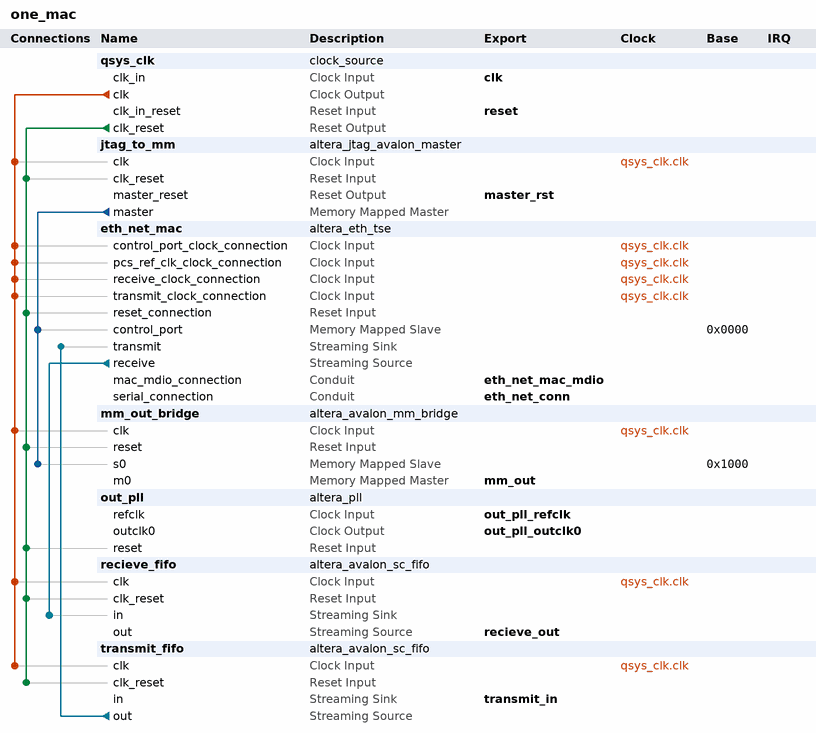
[diagram p0: system contents]
# Platform Designer (Qsys) system one_mac, Cyclone V 5CSXFC6D6F31I7
# Parameters at their usual value, and those the tool derives, are not listed.
package require -exact qsys 19.1
create_system one_mac
set_project_property DEVICE_FAMILY {Cyclone V}
set_project_property DEVICE 5CSXFC6D6F31I7

add_instance qsys_clk clock_source 19.1
set_instance_parameter_value qsys_clk clockFrequency 50000000

add_instance jtag_to_mm altera_jtag_avalon_master 19.1

add_instance eth_net_mac altera_eth_tse 19.1
set_instance_parameter_value eth_net_mac XCVR_RCFG_JTAG_ENABLE 0
set_instance_parameter_value eth_net_mac XCVR_SET_CAPABILITY_REG_ENABLE 0
set_instance_parameter_value eth_net_mac XCVR_SET_CSR_SOFT_LOGIC_ENABLE 0
set_instance_parameter_value eth_net_mac XCVR_SET_PRBS_SOFT_LOGIC_ENABLE 0
set_instance_parameter_value eth_net_mac XCVR_SET_USER_IDENTIFIER 0
set_instance_parameter_value eth_net_mac core_variation MAC_PCS
set_instance_parameter_value eth_net_mac enable_hd_logic false
set_instance_parameter_value eth_net_mac enable_mac_flow_ctrl false
set_instance_parameter_value eth_net_mac enable_magic_detect false
set_instance_parameter_value eth_net_mac enable_sgmii true
set_instance_parameter_value eth_net_mac enable_shift16 true
set_instance_parameter_value eth_net_mac ifGMII MII_GMII
set_instance_parameter_value eth_net_mac ing_addr 11
set_instance_parameter_value eth_net_mac mdio_clk_div 125
set_instance_parameter_value eth_net_mac stat_cnt_ena true
set_instance_parameter_value eth_net_mac transceiver_type GXB

add_instance mm_out_bridge altera_avalon_mm_bridge 19.1
set_instance_parameter_value mm_out_bridge ADDRESS_UNITS SYMBOLS
set_instance_parameter_value mm_out_bridge ADDRESS_WIDTH 32
set_instance_parameter_value mm_out_bridge DATA_WIDTH 32
set_instance_parameter_value mm_out_bridge MAX_PENDING_RESPONSES 4
set_instance_parameter_value mm_out_bridge PIPELINE_COMMAND 0
set_instance_parameter_value mm_out_bridge PIPELINE_RESPONSE 0
set_instance_parameter_value mm_out_bridge USE_AUTO_ADDRESS_WIDTH 1

add_instance out_pll altera_pll 19.1
set_instance_parameter_value out_pll gui_device_speed_grade 1
set_instance_parameter_value out_pll gui_number_of_clocks 1
set_instance_parameter_value out_pll gui_operation_mode direct
set_instance_parameter_value out_pll gui_output_clock_frequency0 125.0
set_instance_parameter_value out_pll gui_pll_mode {Integer-N PLL}
set_instance_parameter_value out_pll gui_reference_clock_frequency 125.0
set_instance_parameter_value out_pll gui_use_locked true

add_instance recieve_fifo altera_avalon_sc_fifo 19.1
set_instance_parameter_value recieve_fifo BITS_PER_SYMBOL 8
set_instance_parameter_value recieve_fifo CHANNEL_WIDTH 0
set_instance_parameter_value recieve_fifo ERROR_WIDTH 0
set_instance_parameter_value recieve_fifo FIFO_DEPTH 256
set_instance_parameter_value recieve_fifo SYMBOLS_PER_BEAT 4
set_instance_parameter_value recieve_fifo USE_FILL_LEVEL 0
set_instance_parameter_value recieve_fifo USE_MEMORY_BLOCKS 1
set_instance_parameter_value recieve_fifo USE_PACKETS 1
set_instance_parameter_value recieve_fifo USE_STORE_FORWARD 0

add_instance transmit_fifo altera_avalon_sc_fifo 19.1
set_instance_parameter_value transmit_fifo BITS_PER_SYMBOL 8
set_instance_parameter_value transmit_fifo CHANNEL_WIDTH 0
set_instance_parameter_value transmit_fifo ERROR_WIDTH 0
set_instance_parameter_value transmit_fifo FIFO_DEPTH 256
set_instance_parameter_value transmit_fifo SYMBOLS_PER_BEAT 4
set_instance_parameter_value transmit_fifo USE_FILL_LEVEL 0
set_instance_parameter_value transmit_fifo USE_MEMORY_BLOCKS 1
set_instance_parameter_value transmit_fifo USE_PACKETS 1
set_instance_parameter_value transmit_fifo USE_STORE_FORWARD 0

# connections
add_connection qsys_clk.clk eth_net_mac.control_port_clock_connection clock
add_connection qsys_clk.clk eth_net_mac.pcs_ref_clk_clock_connection clock
add_connection qsys_clk.clk eth_net_mac.receive_clock_connection clock
add_connection qsys_clk.clk eth_net_mac.transmit_clock_connection clock
add_connection qsys_clk.clk jtag_to_mm.clk clock
add_connection qsys_clk.clk mm_out_bridge.clk clock
add_connection qsys_clk.clk recieve_fifo.clk clock
add_connection qsys_clk.clk transmit_fifo.clk clock
add_connection qsys_clk.clk_reset eth_net_mac.reset_connection reset
add_connection qsys_clk.clk_reset jtag_to_mm.clk_reset reset
add_connection qsys_clk.clk_reset mm_out_bridge.reset reset
add_connection qsys_clk.clk_reset out_pll.reset reset
add_connection qsys_clk.clk_reset recieve_fifo.clk_reset reset
add_connection qsys_clk.clk_reset transmit_fifo.clk_reset reset
add_connection jtag_to_mm.master eth_net_mac.control_port avalon
set_connection_parameter_value jtag_to_mm.master/eth_net_mac.control_port baseAddress 0x0000
add_connection jtag_to_mm.master mm_out_bridge.s0 avalon
set_connection_parameter_value jtag_to_mm.master/mm_out_bridge.s0 baseAddress 0x1000
add_connection eth_net_mac.receive recieve_fifo.in avalon_streaming
add_connection transmit_fifo.out eth_net_mac.transmit avalon_streaming

# exported interfaces
add_interface clk clock sink
set_interface_property clk EXPORT_OF qsys_clk.clk_in
add_interface eth_net_conn conduit end
set_interface_property eth_net_conn EXPORT_OF eth_net_mac.serial_connection
add_interface eth_net_mac_mdio conduit end
set_interface_property eth_net_mac_mdio EXPORT_OF eth_net_mac.mac_mdio_connection
add_interface master_rst reset source
set_interface_property master_rst EXPORT_OF jtag_to_mm.master_reset
add_interface mm_out avalon master
set_interface_property mm_out EXPORT_OF mm_out_bridge.m0
add_interface out_pll_outclk0 clock source
set_interface_property out_pll_outclk0 EXPORT_OF out_pll.outclk0
add_interface out_pll_refclk clock sink
set_interface_property out_pll_refclk EXPORT_OF out_pll.refclk
add_interface recieve_out avalon_streaming source
set_interface_property recieve_out EXPORT_OF recieve_fifo.out
add_interface reset reset sink
set_interface_property reset EXPORT_OF qsys_clk.clk_in_reset
add_interface transmit_in avalon_streaming sink
set_interface_property transmit_in EXPORT_OF transmit_fifo.in

set_interconnect_requirement {$system} qsys_mm.clockCrossingAdapter HANDSHAKE
set_interconnect_requirement {$system} qsys_mm.enableEccProtection FALSE
set_interconnect_requirement {$system} qsys_mm.insertDefaultSlave FALSE
set_interconnect_requirement {$system} qsys_mm.maxAdditionalLatency 1

save_system one_mac.qsys
